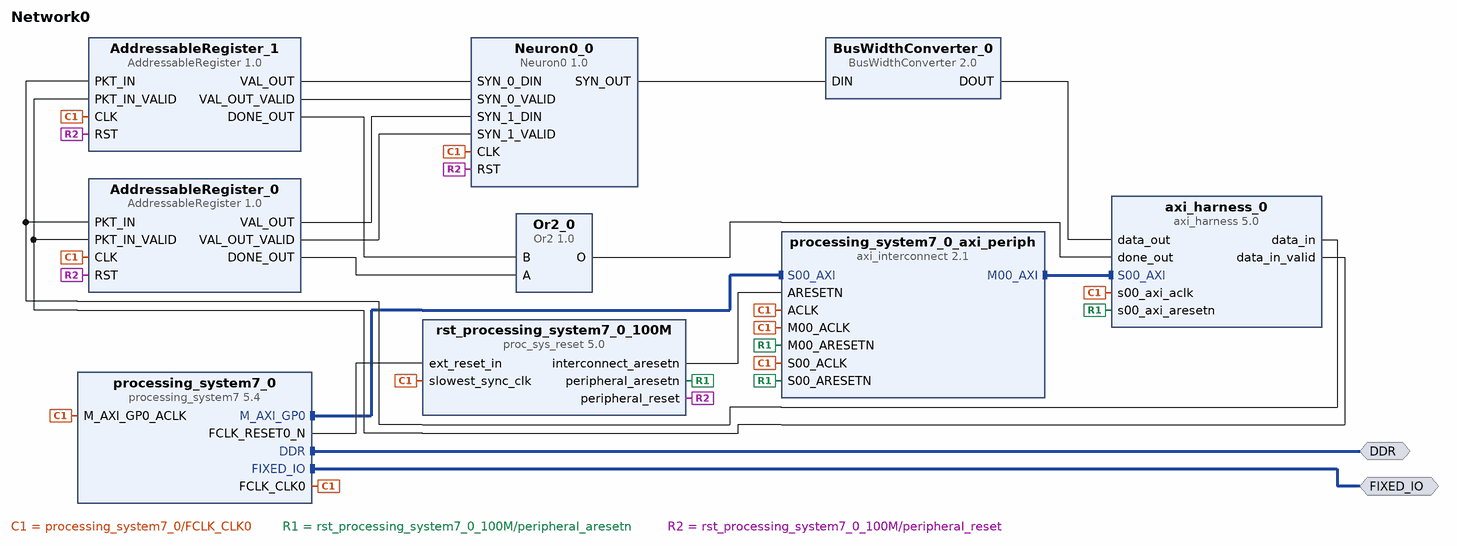
[diagram p0: block diagram of the top level]
# Vivado block design Network0, Vivado 2014.2
create_bd_design Network0

create_bd_intf_port -mode Master -vlnv xilinx.com:interface:ddrx_rtl:1.0 DDR
create_bd_intf_port -mode Master -vlnv xilinx.com:display_processing_system7:fixedio_rtl:1.0 FIXED_IO

create_bd_cell -type ip -vlnv xilinx.com:ip:processing_system7:5.4 processing_system7_0
set_property -dict [list \
  CONFIG.PCW_FCLK_CLK0_BUF true \
  CONFIG.PCW_APU_PERIPHERAL_FREQMHZ 666.666666 \
  CONFIG.PCW_SDIO_PERIPHERAL_FREQMHZ 50 \
  CONFIG.PCW_UART_PERIPHERAL_FREQMHZ 50 \
  CONFIG.PCW_FPGA0_PERIPHERAL_FREQMHZ 100 \
  CONFIG.PCW_FPGA1_PERIPHERAL_FREQMHZ 100 \
  CONFIG.PCW_FPGA2_PERIPHERAL_FREQMHZ 33.333333 \
  CONFIG.PCW_M_AXI_GP0_FREQMHZ 10 \
  CONFIG.PCW_PERIPHERAL_BOARD_PRESET part0 \
  CONFIG.PCW_PRESET_BANK1_VOLTAGE {LVCMOS 1.8V} \
  CONFIG.PCW_UIPARAM_DDR_PARTNO {MT41K256M16 RE-125} \
  CONFIG.PCW_QSPI_PERIPHERAL_ENABLE 1 \
  CONFIG.PCW_QSPI_GRP_SINGLE_SS_ENABLE 1 \
  CONFIG.PCW_QSPI_GRP_SINGLE_SS_IO {MIO 1 .. 6} \
  CONFIG.PCW_QSPI_GRP_FBCLK_ENABLE 1 \
  CONFIG.PCW_QSPI_GRP_FBCLK_IO {MIO 8} \
  CONFIG.PCW_ENET0_PERIPHERAL_ENABLE 1 \
  CONFIG.PCW_ENET0_ENET0_IO {MIO 16 .. 27} \
  CONFIG.PCW_ENET0_GRP_MDIO_ENABLE 1 \
  CONFIG.PCW_ENET0_GRP_MDIO_IO {MIO 52 .. 53} \
  CONFIG.PCW_SD0_PERIPHERAL_ENABLE 1 \
  CONFIG.PCW_SD0_SD0_IO {MIO 40 .. 45} \
  CONFIG.PCW_SD0_GRP_CD_ENABLE 1 \
  CONFIG.PCW_SD0_GRP_CD_IO {MIO 46} \
  CONFIG.PCW_SD0_GRP_WP_ENABLE 1 \
  CONFIG.PCW_SD0_GRP_WP_IO {MIO 50} \
  CONFIG.PCW_UART1_PERIPHERAL_ENABLE 1 \
  CONFIG.PCW_UART1_UART1_IO {MIO 48 .. 49} \
  CONFIG.PCW_TTC0_PERIPHERAL_ENABLE 1 \
  CONFIG.PCW_TTC0_TTC0_IO EMIO \
  CONFIG.PCW_USB0_PERIPHERAL_ENABLE 1 \
  CONFIG.PCW_USB0_USB0_IO {MIO 28 .. 39} \
  CONFIG.PCW_USB0_RESET_ENABLE 1 \
  CONFIG.PCW_USB0_RESET_IO {MIO 7} \
  CONFIG.PCW_GPIO_PERIPHERAL_ENABLE 1 \
  CONFIG.PCW_GPIO_MIO_GPIO_ENABLE 1 \
  CONFIG.preset {Default*} \
] [get_bd_cells processing_system7_0]
# 167 more settings of processing_system7_0 are not shown: defaults, MIO pin electricals, DDR timing, and values the tool derives
create_bd_cell -type ip -vlnv xilinx.com:ip:axi_interconnect:2.1 processing_system7_0_axi_periph
set_property -dict {CONFIG.NUM_MI 1} [get_bd_cells processing_system7_0_axi_periph]
create_bd_cell -type ip -vlnv xilinx.com:ip:proc_sys_reset:5.0 rst_processing_system7_0_100M
create_bd_cell -type ip -vlnv oloftus.com:prif:AddressableRegister:1.0 AddressableRegister_0
set_property -dict {CONFIG.address 2 CONFIG.addressWidth 19 CONFIG.dataWidth 13} [get_bd_cells AddressableRegister_0]
create_bd_cell -type ip -vlnv oloftus.com:prif:AddressableRegister:1.0 AddressableRegister_1
set_property -dict {CONFIG.address 1 CONFIG.addressWidth 19 CONFIG.dataWidth 13} [get_bd_cells AddressableRegister_1]
create_bd_cell -type ip -vlnv xilinx.com:ip:Or2:1.0 Or2_0
create_bd_cell -type ip -vlnv oloftus:prif:BusWidthConverter:2.0 BusWidthConverter_0
set_property -dict {CONFIG.dinWidth 12 CONFIG.doutWidth 32} [get_bd_cells BusWidthConverter_0]
create_bd_cell -type ip -vlnv oloftus.com:prif:axi_harness:5.0 axi_harness_0
create_bd_cell -type ip -vlnv xilinx.com:ip:Neuron0:1.0 Neuron0_0

# ---- connections ----

connect_bd_intf_net [get_bd_intf_pins processing_system7_0/M_AXI_GP0] [get_bd_intf_pins processing_system7_0_axi_periph/S00_AXI]
connect_bd_intf_net [get_bd_intf_pins processing_system7_0_axi_periph/M00_AXI] [get_bd_intf_pins axi_harness_0/S00_AXI]
connect_bd_intf_net [get_bd_intf_ports DDR] [get_bd_intf_pins processing_system7_0/DDR]
connect_bd_intf_net [get_bd_intf_ports FIXED_IO] [get_bd_intf_pins processing_system7_0/FIXED_IO]
connect_bd_net [get_bd_pins processing_system7_0/FCLK_CLK0] \
  [get_bd_pins processing_system7_0/M_AXI_GP0_ACLK] [get_bd_pins processing_system7_0_axi_periph/S00_ACLK] \
  [get_bd_pins rst_processing_system7_0_100M/slowest_sync_clk] [get_bd_pins processing_system7_0_axi_periph/ACLK] \
  [get_bd_pins processing_system7_0_axi_periph/M00_ACLK] [get_bd_pins AddressableRegister_1/CLK] \
  [get_bd_pins AddressableRegister_0/CLK] [get_bd_pins axi_harness_0/s00_axi_aclk] [get_bd_pins Neuron0_0/CLK]
connect_bd_net [get_bd_pins rst_processing_system7_0_100M/peripheral_aresetn] \
  [get_bd_pins processing_system7_0_axi_periph/S00_ARESETN] [get_bd_pins processing_system7_0_axi_periph/M00_ARESETN] \
  [get_bd_pins axi_harness_0/s00_axi_aresetn]
connect_bd_net [get_bd_pins rst_processing_system7_0_100M/interconnect_aresetn] [get_bd_pins processing_system7_0_axi_periph/ARESETN]
connect_bd_net [get_bd_pins Or2_0/O] [get_bd_pins axi_harness_0/done_out]
connect_bd_net [get_bd_pins AddressableRegister_1/DONE_OUT] [get_bd_pins Or2_0/B]
connect_bd_net [get_bd_pins AddressableRegister_0/DONE_OUT] [get_bd_pins Or2_0/A]
connect_bd_net [get_bd_pins axi_harness_0/data_in] [get_bd_pins AddressableRegister_0/PKT_IN] [get_bd_pins AddressableRegister_1/PKT_IN]
connect_bd_net [get_bd_pins axi_harness_0/data_in_valid] \
  [get_bd_pins AddressableRegister_1/PKT_IN_VALID] [get_bd_pins AddressableRegister_0/PKT_IN_VALID]
connect_bd_net [get_bd_pins AddressableRegister_1/VAL_OUT] [get_bd_pins Neuron0_0/SYN_0_DIN]
connect_bd_net [get_bd_pins AddressableRegister_1/VAL_OUT_VALID] [get_bd_pins Neuron0_0/SYN_0_VALID]
connect_bd_net [get_bd_pins AddressableRegister_0/VAL_OUT] [get_bd_pins Neuron0_0/SYN_1_DIN]
connect_bd_net [get_bd_pins AddressableRegister_0/VAL_OUT_VALID] [get_bd_pins Neuron0_0/SYN_1_VALID]
connect_bd_net [get_bd_pins processing_system7_0/FCLK_RESET0_N] [get_bd_pins rst_processing_system7_0_100M/ext_reset_in]
connect_bd_net [get_bd_pins rst_processing_system7_0_100M/peripheral_reset] \
  [get_bd_pins AddressableRegister_0/RST] [get_bd_pins AddressableRegister_1/RST] [get_bd_pins Neuron0_0/RST]
connect_bd_net [get_bd_pins Neuron0_0/SYN_OUT] [get_bd_pins BusWidthConverter_0/DIN]
connect_bd_net [get_bd_pins BusWidthConverter_0/DOUT] [get_bd_pins axi_harness_0/data_out]

# ---- address map ----
assign_bd_address -offset 0x43C00000 -range 64K -target_address_space [get_bd_addr_spaces processing_system7_0/Data] [get_bd_addr_segs axi_harness_0/S00_AXI/S00_AXI_reg]

validate_bd_design
save_bd_design
